# EAGLE schematic MSUT (EAGLE 9.6.2)

## Sheet 1 of 2
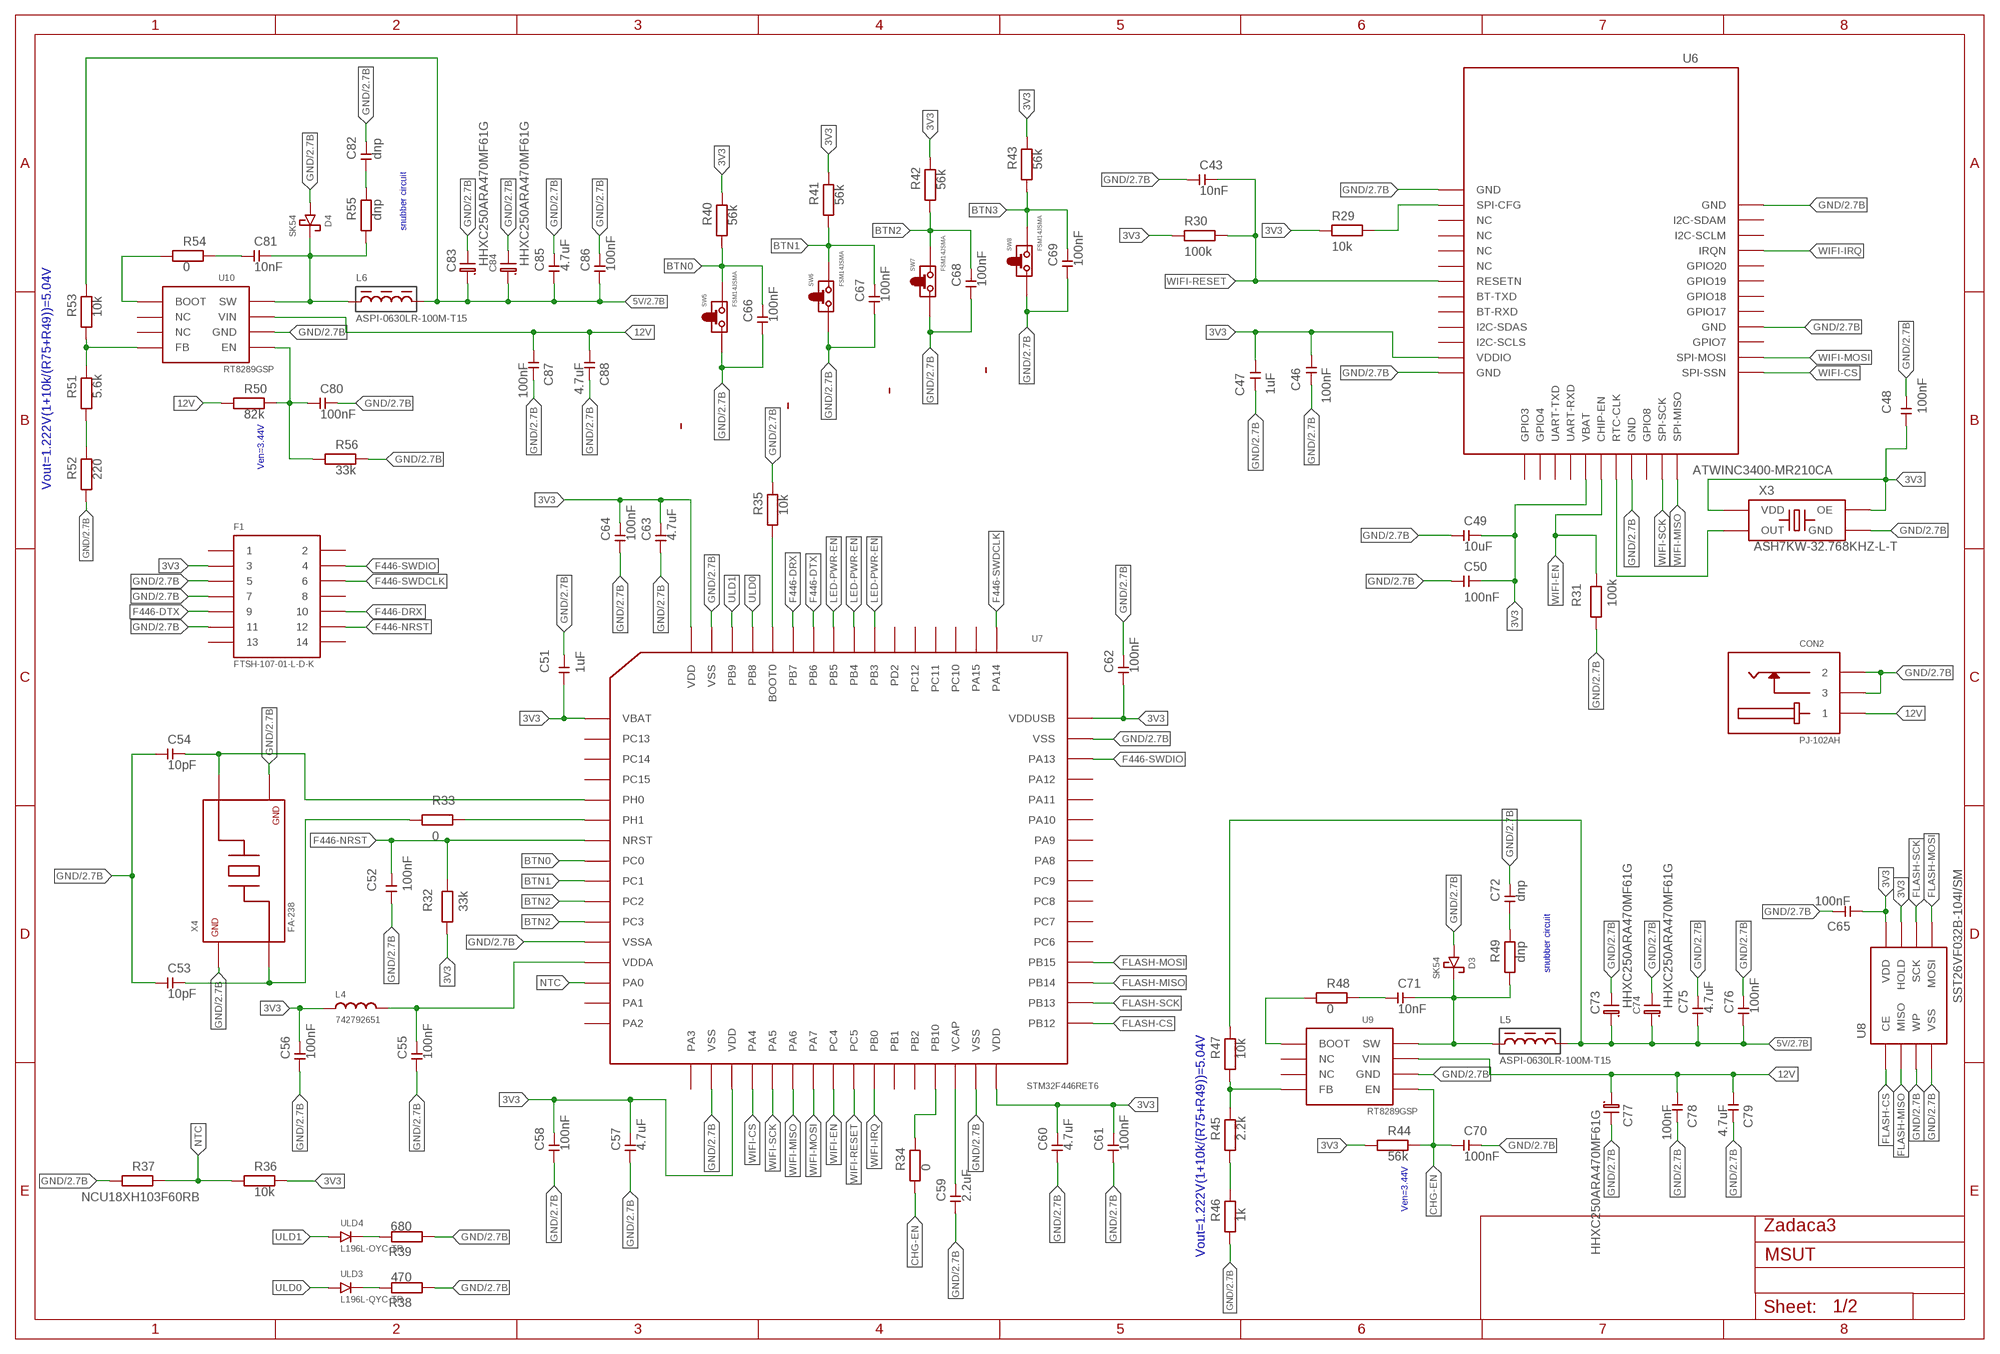
[diagram p0: schematic, sheet 1]

### Parts
C43  10nF  CAPACITORB  [PACKAGE_0805]
C46  100nF  CAPACITORB  [PACKAGE_0805]
C47  1uF  CAPACITORB  [PACKAGE_0805]
C48  100nF  CAPACITORB  [PACKAGE_0805]
C49  10uF  CAPACITORB  [PACKAGE_0805]
C50  100nF  CAPACITORB  [PACKAGE_0805]
C51  1uF  CAPACITORB  [PACKAGE_0805]
C52  100nF  CAPACITORB  [PACKAGE_0805]
C53  10pF  CAPACITORB  [PACKAGE_0805]
C54  10pF  CAPACITORB  [PACKAGE_0805]
C55  100nF  CAPACITORB  [PACKAGE_0805]
C56  100nF  CAPACITORB  [PACKAGE_0805]
C57  4.7uF  CAPACITORB  [PACKAGE_0805]
C58  100nF  CAPACITORB  [PACKAGE_0805]
C59  2.2uF  CAPACITORB  [PACKAGE_0805]
C60  4.7uF  CAPACITORB  [PACKAGE_0805]
C61  100nF  CAPACITORB  [PACKAGE_0805]
C62  100nF  CAPACITORB  [PACKAGE_0805]
C63  4.7uF  CAPACITORB  [PACKAGE_0805]
C64  100nF  CAPACITORB  [PACKAGE_0805]
C65  100nF  CAPACITORB  [PACKAGE_0805]
C66  100nF  CAPACITORB  [PACKAGE_0805]
C67  100nF  CAPACITORB  [PACKAGE_0805]
C68  100nF  CAPACITORB  [PACKAGE_0805]
C69  100nF  CAPACITORB  [PACKAGE_0805]
C70  100nF  CAPACITORB  [PACKAGE_0805]
C71  10nF  CAPACITORB  [PACKAGE_0805]
C72  dnp  CAPACITORB  [PACKAGE_0805]
C73  HHXC250ARA470MF61G  ELECTROLIC_CAPACTIOR  [PACKAGE_EL_CAP_HXC]
C74  HHXC250ARA470MF61G  ELECTROLIC_CAPACTIOR  [PACKAGE_EL_CAP_HXC]
C75  4.7uF  CAPACITORB  [PACKAGE_0805]
C76  100nF  CAPACITORB  [PACKAGE_0805]
C77  HHXB350ARA470MF61G  ELECTROLIC_CAPACTIOR  [PACKAGE_EL_CAP_HXC]
C78  100nF  CAPACITORB  [PACKAGE_0805]
C79  4.7uF  CAPACITORB  [PACKAGE_0805]
C80  100nF  CAPACITORB  [PACKAGE_0805]
C81  10nF  CAPACITORB  [PACKAGE_0805]
C82  dnp  CAPACITORB  [PACKAGE_0805]
C83  HHXC250ARA470MF61G  ELECTROLIC_CAPACTIOR  [PACKAGE_EL_CAP_HXC]
C84  HHXC250ARA470MF61G  ELECTROLIC_CAPACTIOR  [PACKAGE_EL_CAP_HXC]
C85  4.7uF  CAPACITORB  [PACKAGE_0805]
C86  100nF  CAPACITORB  [PACKAGE_0805]
C87  100nF  CAPACITORB  [PACKAGE_0805]
C88  4.7uF  CAPACITORB  [PACKAGE_0805]
CON2  PJ-102AH  PJ-102AH_CONNECTOR  [TRAY_PJ-102AH]
D3  SK54  SHOTTKY_DIODE  [D0-214AB]
D4  SK54  SHOTTKY_DIODE  [D0-214AB]
F1  FTSH-107-01-L-D-K  [TUBE_FTSH-107-01-L-D-K]
L4  742792651  INDUCTOR  [PACKAGE_0805]
L5  ASPI-0630LR-100M-T15  [PACKAGE_ASPI-0630]
L6  ASPI-0630LR-100M-T15  [PACKAGE_ASPI-0630]
R29  10k  RESISTOR  [PACKAGE_0805]
R30  100k  RESISTOR  [PACKAGE_0805]
R31  100k  RESISTOR  [PACKAGE_0805]
R32  33k  RESISTOR  [PACKAGE_0805]
R33  0  RESISTOR  [PACKAGE_0805]
R34  0  RESISTOR  [PACKAGE_0805]
R35  10k  RESISTOR  [PACKAGE_0805]
R36  10k  RESISTOR  [PACKAGE_0805]
R37  NCU18XH103F60RB  RESISTOR  [PACKAGE_0805]
R38  470  RESISTOR  [PACKAGE_0805]
R39  680  RESISTOR  [PACKAGE_0805]
R40  56k  RESISTOR  [PACKAGE_0805]
R41  56k  RESISTOR  [PACKAGE_0805]
R42  56k  RESISTOR  [PACKAGE_0805]
R43  56k  RESISTOR  [PACKAGE_0805]
R44  56k  RESISTOR  [PACKAGE_0805]
R45  2.2k  RESISTOR  [PACKAGE_0805]
R46  1k  RESISTOR  [PACKAGE_0805]
R47  10k  RESISTOR  [PACKAGE_0805]
R48  0  RESISTOR  [PACKAGE_0805]
R49  dnp  RESISTOR  [PACKAGE_0805]
R50  82k  RESISTOR  [PACKAGE_0805]
R51  5.6k  RESISTOR  [PACKAGE_0805]
R52  220  RESISTOR  [PACKAGE_0805]
R53  10k  RESISTOR  [PACKAGE_0805]
R54  0  RESISTOR  [PACKAGE_0805]
R55  dnp  RESISTOR  [PACKAGE_0805]
R56  33k  RESISTOR  [PACKAGE_0805]
SW5  FSM14JSMA  PUSHBUTTON  [FSM14JSMA]
SW6  FSM14JSMA  PUSHBUTTON  [FSM14JSMA]
SW7  FSM14JSMA  PUSHBUTTON  [FSM14JSMA]
SW8  FSM14JSMA  PUSHBUTTON  [FSM14JSMA]
U6  NETWORK_CONTROLLER  [PACKAGE_ATWINC3400-MR210XA]
U7  STM32F446RET6  [TRAY_STM32F446RET6]
U8  SST26VF032B-104I/SM  [8-SOIJ]
U9  RT8289GSP  [8-SOIC]
U10  RT8289GSP  [8-SOIC]
ULD3  L196L-QYC-TR  LED  [TAPE&REEL_DIODE]
ULD4  L196L-OYC-TR  LED  [TAPE&REEL_DIODE]
X3  ASH7KW-32.768KHZ-L-T  [PACKAGE_ASH7KW]
X4  FA-238  [PACKAGE_FA-23816.0000MB-K0]

### Nets
3V3: C46.P1 C47.P1 C48.P1 C49.P2 C50.P2 C51.P1 C56.P2 C57.P2 C58.P2 C60.P2 C61.P2 C62.P1 C63.P2 C64.P2 C65.P1 F1.3 L4.P1(PIN1) R29.P1 R30.P1 R32.P1 R36.P2 R40.P2 R41.P2 R42.P2 R43.P2 R44.P1 U6.VBAT U6.VDDIO U7.VBAT U7.VDD1(VDD) U7.VDD2(VDD) U7.VDD3(VDD) U7.VDDUSB U8.HOLD U8.VDD X3.OE X3.VDD
5V: C73.P1 C74.P1 C75.P1 C76.P1 C83.P1 C84.P1 C85.P1 C86.P1 L5.PIN2 L6.PIN2 R47.P2 R53.P2 ; also sheet 2
12V: C77.P1 C78.P1 C79.P1 C87.P1 C88.P1 CON2.1 R50.P1 U9.VIN U10.VIN
BTN0: C66.P2 R40.P1 SW5.3(PIN2) SW5.4(PIN2) U7.PC0
BTN1: C67.P2 R41.P1 SW6.3(PIN2) SW6.4(PIN2) U7.PC1
BTN2: C68.P2 R42.P1 SW7.3(PIN2) SW7.4(PIN2) U7.PC2 U7.PC3
BTN3: C69.P2 R43.P1 SW8.3(PIN2) SW8.4(PIN2)
CHG-EN: C70.P1 C80.P1 R34.P1 R44.P2 R50.P2 R56.P1 U9.EN U10.EN
F446-DRX: F1.10 U7.PB7
F446-DTX: F1.9 U7.PB6
F446-NRST: C52.P2 F1.12 R32.P2 U7.NRST
F446-SWDCLK: F1.6 U7.PA14
F446-SWDIO: F1.4 U7.PA13
FLASH-CS: U7.PB12 U8.CE
FLASH-MISO: U7.PB14 U8.MISO
FLASH-MOSI: U7.PB15 U8.MOSI
FLASH-SCK: U7.PB13 U8.SCK
GND: C43.P1 C46.P2 C47.P2 C48.P2 C49.P1 C50.P1 C51.P2 C52.P1 C53.P1 C54.P1 C55.P1 C56.P1 C57.P1 C58.P1 C59.P1 C60.P1 C61.P1 C62.P2 C63.P1 C64.P1 C65.P2 C66.P1 C67.P1 C68.P1 C69.P1 C70.P2 C72.P2 C73.P2 C74.P2 C75.P2 C76.P2 C77.P2 C78.P2 C79.P2 C80.P2 C82.P2 C83.P2 C84.P2 C85.P2 C86.P2 C87.P2 C88.P2 CON2.2 CON2.3 D3.ANODE D4.ANODE F1.5 F1.7 F1.11 R31.P1 R35.P2 R37.P1 R38.P1 R39.P1 R46.P1 R52.P1 R56.P2 SW5.1(PIN1) SW5.2(PIN1) SW6.1(PIN1) SW6.2(PIN1) SW7.1(PIN1) SW7.2(PIN1) SW8.1(PIN1) SW8.2(PIN1) U6.GND@1(GND) U6.GND@2(GND) U6.GND@3(GND) U6.GND@4(GND) U6.GND@5(GND) U6.GND@6(GND) U7.VSS1(VSS) U7.VSS2(VSS) U7.VSS3(VSS) U7.VSS4(VSS) U7.VSSA U8.VSS U8.WP U9.GND1(GND) U9.GND2(GND) U10.GND1(GND) U10.GND2(GND) X3.GND X4.2(GND) X4.4(GND) ; also sheet 2
LED-PWR-EN: U7.PB3 U7.PB4 U7.PB5
N$25: R29.P2 U6.SPI-CFG
N$27: U6.RTC-CLK X3.OUT
N$28: R33.P2 U7.PH1
N$29: C53.P2 R33.P1 X4.1(PIN1)
N$30: C54.P2 U7.PH0 X4.3(PIN2)
N$31: C55.P2 L4.P2(PIN2) U7.VDDA
N$32: R34.P2 U7.PB10
N$33: C59.P2 U7.VCAP
N$34: R35.P1 U7.BOOT0
N$35: R38.P2 ULD3.CATHODE
N$36: R39.P2 ULD4.CATHODE
N$37: R45.P2 R47.P1 U9.FB
N$38: R45.P1 R46.P2
N$39: C71.P1 R48.P2
N$40: R48.P1 U9.BOOT
N$41: C71.P2 D3.CATHODE L5.PIN1 R49.P1 U9.SW
N$42: C72.P1 R49.P2
N$43: R51.P2 R53.P1 U10.FB
N$44: R51.P1 R52.P2
N$45: C81.P1 R54.P2
N$46: R54.P1 U10.BOOT
N$47: C81.P2 D4.CATHODE L6.PIN1 R55.P1 U10.SW
N$48: C82.P1 R55.P2
NTC: R36.P1 R37.P2 U7.PA0
ULD0: U7.PB8 ULD3.ANODE
ULD1: U7.PB9 ULD4.ANODE
WIFI-CS: U6.SPI-SSN U7.PA4
WIFI-EN: R31.P2 U6.CHIP-EN U7.PC4
WIFI-IRQ: U6.IRQN U7.PB0
WIFI-MISO: U6.SPI-MISO U7.PA6
WIFI-MOSI: U6.SPI-MOSI U7.PA7
WIFI-RESET: C43.P2 R30.P2 U6.RESETN U7.PC5
WIFI-SCK: U6.SPI-SCK U7.PA5
Unconnected: F1.1 F1.2 F1.8 F1.13 F1.14 U6.BT-RXD U6.BT-TXD U6.GPIO3 U6.GPIO4 U6.GPIO7 U6.GPIO8 U6.GPIO17 U6.GPIO18 U6.GPIO19 U6.GPIO20 U6.I2C-SCLM U6.I2C-SCLS U6.I2C-SDAM U6.I2C-SDAS U6.NC@1(NC) U6.NC@2(NC) U6.NC@3(NC) U6.NC@4(NC) U6.UART-RXD U6.UART-TXD U7.PA1 U7.PA2 U7.PA3 U7.PA8 U7.PA9 U7.PA10 U7.PA11 U7.PA12 U7.PA15 U7.PB1 U7.PB2 U7.PC6 U7.PC7 U7.PC8 U7.PC9 U7.PC10 U7.PC11 U7.PC12 U7.PC13 U7.PC14 U7.PC15 U7.PD2 U9.NC1(NC) U9.NC2(NC) U10.NC1(NC) U10.NC2(NC)

### Notes on the sheet
- snubber circuit
- Ven=3.44V
- Vout=1.222V(1+10k/(R75+R49))=5.04V
- snubber circuit
- Ven=3.44V
- Zadaca3
- Vout=1.222V(1+10k/(R75+R49))=5.04V

## Sheet 2 of 2
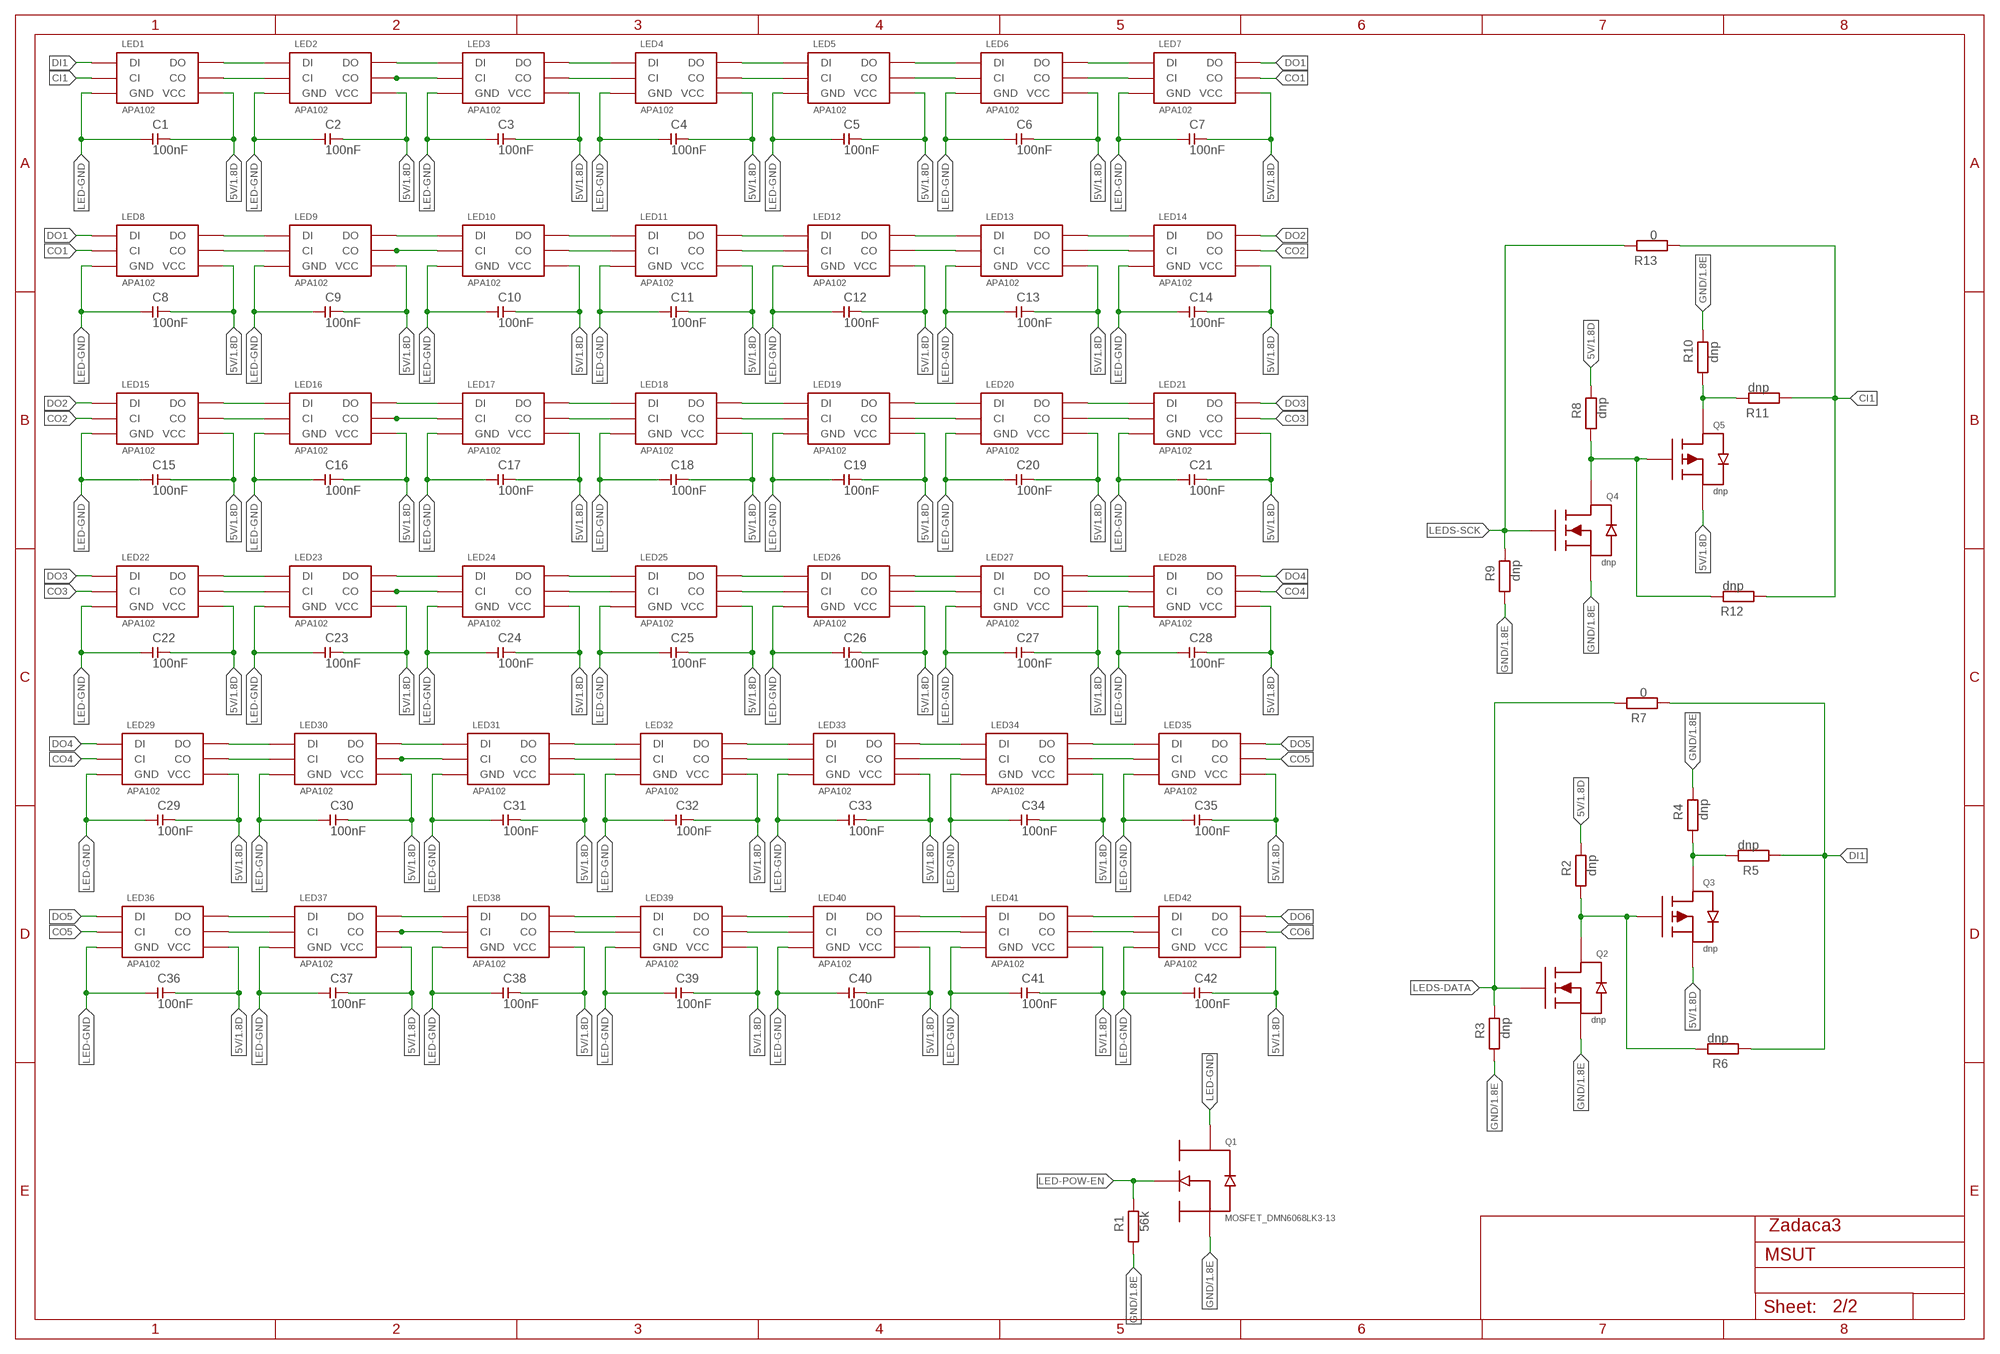
[diagram p1: schematic, sheet 2]

### Parts
C1  100nF  CAPACITORB  [PACKAGE_0805]
C2  100nF  CAPACITORB  [PACKAGE_0805]
C3  100nF  CAPACITORB  [PACKAGE_0805]
C4  100nF  CAPACITORB  [PACKAGE_0805]
C5  100nF  CAPACITORB  [PACKAGE_0805]
C6  100nF  CAPACITORB  [PACKAGE_0805]
C7  100nF  CAPACITORB  [PACKAGE_0805]
C8  100nF  CAPACITORB  [PACKAGE_0805]
C9  100nF  CAPACITORB  [PACKAGE_0805]
C10  100nF  CAPACITORB  [PACKAGE_0805]
C11  100nF  CAPACITORB  [PACKAGE_0805]
C12  100nF  CAPACITORB  [PACKAGE_0805]
C13  100nF  CAPACITORB  [PACKAGE_0805]
C14  100nF  CAPACITORB  [PACKAGE_0805]
C15  100nF  CAPACITORB  [PACKAGE_0805]
C16  100nF  CAPACITORB  [PACKAGE_0805]
C17  100nF  CAPACITORB  [PACKAGE_0805]
C18  100nF  CAPACITORB  [PACKAGE_0805]
C19  100nF  CAPACITORB  [PACKAGE_0805]
C20  100nF  CAPACITORB  [PACKAGE_0805]
C21  100nF  CAPACITORB  [PACKAGE_0805]
C22  100nF  CAPACITORB  [PACKAGE_0805]
C23  100nF  CAPACITORB  [PACKAGE_0805]
C24  100nF  CAPACITORB  [PACKAGE_0805]
C25  100nF  CAPACITORB  [PACKAGE_0805]
C26  100nF  CAPACITORB  [PACKAGE_0805]
C27  100nF  CAPACITORB  [PACKAGE_0805]
C28  100nF  CAPACITORB  [PACKAGE_0805]
C29  100nF  CAPACITORB  [PACKAGE_0805]
C30  100nF  CAPACITORB  [PACKAGE_0805]
C31  100nF  CAPACITORB  [PACKAGE_0805]
C32  100nF  CAPACITORB  [PACKAGE_0805]
C33  100nF  CAPACITORB  [PACKAGE_0805]
C34  100nF  CAPACITORB  [PACKAGE_0805]
C35  100nF  CAPACITORB  [PACKAGE_0805]
C36  100nF  CAPACITORB  [PACKAGE_0805]
C37  100nF  CAPACITORB  [PACKAGE_0805]
C38  100nF  CAPACITORB  [PACKAGE_0805]
C39  100nF  CAPACITORB  [PACKAGE_0805]
C40  100nF  CAPACITORB  [PACKAGE_0805]
C41  100nF  CAPACITORB  [PACKAGE_0805]
C42  100nF  CAPACITORB  [PACKAGE_0805]
LED1  RGB_LED  [TAPE&REEL_LED]
LED2  RGB_LED  [TAPE&REEL_LED]
LED3  RGB_LED  [TAPE&REEL_LED]
LED4  RGB_LED  [TAPE&REEL_LED]
LED5  RGB_LED  [TAPE&REEL_LED]
LED6  RGB_LED  [TAPE&REEL_LED]
LED7  RGB_LED  [TAPE&REEL_LED]
LED8  RGB_LED  [TAPE&REEL_LED]
LED9  RGB_LED  [TAPE&REEL_LED]
LED10  RGB_LED  [TAPE&REEL_LED]
LED11  RGB_LED  [TAPE&REEL_LED]
LED12  RGB_LED  [TAPE&REEL_LED]
LED13  RGB_LED  [TAPE&REEL_LED]
LED14  RGB_LED  [TAPE&REEL_LED]
LED15  RGB_LED  [TAPE&REEL_LED]
LED16  RGB_LED  [TAPE&REEL_LED]
LED17  RGB_LED  [TAPE&REEL_LED]
LED18  RGB_LED  [TAPE&REEL_LED]
LED19  RGB_LED  [TAPE&REEL_LED]
LED20  RGB_LED  [TAPE&REEL_LED]
LED21  RGB_LED  [TAPE&REEL_LED]
LED22  RGB_LED  [TAPE&REEL_LED]
LED23  RGB_LED  [TAPE&REEL_LED]
LED24  RGB_LED  [TAPE&REEL_LED]
LED25  RGB_LED  [TAPE&REEL_LED]
LED26  RGB_LED  [TAPE&REEL_LED]
LED27  RGB_LED  [TAPE&REEL_LED]
LED28  RGB_LED  [TAPE&REEL_LED]
LED29  RGB_LED  [TAPE&REEL_LED]
LED30  RGB_LED  [TAPE&REEL_LED]
LED31  RGB_LED  [TAPE&REEL_LED]
LED32  RGB_LED  [TAPE&REEL_LED]
LED33  RGB_LED  [TAPE&REEL_LED]
LED34  RGB_LED  [TAPE&REEL_LED]
LED35  RGB_LED  [TAPE&REEL_LED]
LED36  RGB_LED  [TAPE&REEL_LED]
LED37  RGB_LED  [TAPE&REEL_LED]
LED38  RGB_LED  [TAPE&REEL_LED]
LED39  RGB_LED  [TAPE&REEL_LED]
LED40  RGB_LED  [TAPE&REEL_LED]
LED41  RGB_LED  [TAPE&REEL_LED]
LED42  RGB_LED  [TAPE&REEL_LED]
Q1  MOSFET_DMN6068LK3-13  [TO252-3L]
Q2  NCHANNEL_MOSFET  [SOT-23-3]
Q3  PCHANNEL_MOSFET  [SOT-23-3]
Q4  NCHANNEL_MOSFET  [SOT-23-3]
Q5  PCHANNEL_MOSFET  [SOT-23-3]
R1  56k  RESISTOR  [PACKAGE_0805]
R2  dnp  RESISTOR  [PACKAGE_0805]
R3  dnp  RESISTOR  [PACKAGE_0805]
R4  dnp  RESISTOR  [PACKAGE_0805]
R5  dnp  RESISTOR  [PACKAGE_0805]
R6  dnp  RESISTOR  [PACKAGE_0805]
R7  0  RESISTOR  [PACKAGE_0805]
R8  dnp  RESISTOR  [PACKAGE_0805]
R9  dnp  RESISTOR  [PACKAGE_0805]
R10  dnp  RESISTOR  [PACKAGE_0805]
R11  dnp  RESISTOR  [PACKAGE_0805]
R12  dnp  RESISTOR  [PACKAGE_0805]
R13  0  RESISTOR  [PACKAGE_0805]

### Nets
5V: C1.P2 C2.P2 C3.P2 C4.P2 C5.P2 C6.P2 C7.P2 C8.P2 C9.P2 C10.P2 C11.P2 C12.P2 C13.P2 C14.P2 C15.P2 C16.P2 C17.P2 C18.P2 C19.P2 C20.P2 C21.P2 C22.P2 C23.P2 C24.P2 C25.P2 C26.P2 C27.P2 C28.P2 C29.P2 C30.P2 C31.P2 C32.P2 C33.P2 C34.P2 C35.P2 C36.P2 C37.P2 C38.P2 C39.P2 C40.P2 C41.P2 C42.P2 LED1.VDD(VCC) LED2.VDD(VCC) LED3.VDD(VCC) LED4.VDD(VCC) LED5.VDD(VCC) LED6.VDD(VCC) LED7.VDD(VCC) LED8.VDD(VCC) LED9.VDD(VCC) LED10.VDD(VCC) LED11.VDD(VCC) LED12.VDD(VCC) LED13.VDD(VCC) LED14.VDD(VCC) LED15.VDD(VCC) LED16.VDD(VCC) LED17.VDD(VCC) LED18.VDD(VCC) LED19.VDD(VCC) LED20.VDD(VCC) LED21.VDD(VCC) LED22.VDD(VCC) LED23.VDD(VCC) LED24.VDD(VCC) LED25.VDD(VCC) LED26.VDD(VCC) LED27.VDD(VCC) LED28.VDD(VCC) LED29.VDD(VCC) LED30.VDD(VCC) LED31.VDD(VCC) LED32.VDD(VCC) LED33.VDD(VCC) LED34.VDD(VCC) LED35.VDD(VCC) LED36.VDD(VCC) LED37.VDD(VCC) LED38.VDD(VCC) LED39.VDD(VCC) LED40.VDD(VCC) LED41.VDD(VCC) LED42.VDD(VCC) Q3.SOURCE Q5.SOURCE R2.P2 R8.P2 ; also sheet 1
CI1: LED1.CI R11.P1 R12.P1 R13.P1
CO1: LED7.CO LED8.CI
CO2: LED14.CO LED15.CI
CO3: LED21.CO LED22.CI
CO4: LED28.CO LED29.CI
CO5: LED35.CO LED36.CI
CO6: LED42.CO
DI1: LED1.DI R5.P1 R6.P1 R7.P1
DO1: LED7.DO LED8.DI
DO2: LED14.DO LED15.DI
DO3: LED21.DO LED22.DI
DO4: LED28.DO LED29.DI
DO5: LED35.DO LED36.DI
DO6: LED42.DO
GND: Q1.DRAIN Q2.SOURCE Q4.SOURCE R1.P1 R3.P1 R4.P2 R9.P1 R10.P2 ; also sheet 1
LED-GND: C1.P1 C2.P1 C3.P1 C4.P1 C5.P1 C6.P1 C7.P1 C8.P1 C9.P1 C10.P1 C11.P1 C12.P1 C13.P1 C14.P1 C15.P1 C16.P1 C17.P1 C18.P1 C19.P1 C20.P1 C21.P1 C22.P1 C23.P1 C24.P1 C25.P1 C26.P1 C27.P1 C28.P1 C29.P1 C30.P1 C31.P1 C32.P1 C33.P1 C34.P1 C35.P1 C36.P1 C37.P1 C38.P1 C39.P1 C40.P1 C41.P1 C42.P1 LED1.GND LED2.GND LED3.GND LED4.GND LED5.GND LED6.GND LED7.GND LED8.GND LED9.GND LED10.GND LED11.GND LED12.GND LED13.GND LED14.GND LED15.GND LED16.GND LED17.GND LED18.GND LED19.GND LED20.GND LED21.GND LED22.GND LED23.GND LED24.GND LED25.GND LED26.GND LED27.GND LED28.GND LED29.GND LED30.GND LED31.GND LED32.GND LED33.GND LED34.GND LED35.GND LED36.GND LED37.GND LED38.GND LED39.GND LED40.GND LED41.GND LED42.GND Q1.SOURCE
LED-POW-EN: Q1.GATE R1.P2
LEDS-DATA: Q2.GATE R3.P2 R7.P2
LEDS-SCK: Q4.GATE R9.P2 R13.P2
N$1: LED1.DO LED2.DI
N$2: LED1.CO LED2.CI
N$3: LED2.DO LED3.DI
N$4: LED2.CO LED3.CI
N$5: LED3.DO LED4.DI
N$6: LED3.CO LED4.CI
N$7: LED4.DO LED5.DI
N$8: LED4.CO LED5.CI
N$9: LED5.DO LED6.DI
N$10: LED5.CO LED6.CI
N$11: LED6.DO LED7.DI
N$12: LED6.CO LED7.CI
N$13: LED8.DO LED9.DI
N$14: LED8.CO LED9.CI
N$15: LED9.DO LED10.DI
N$16: LED9.CO LED10.CI
N$17: LED10.DO LED11.DI
N$18: LED10.CO LED11.CI
N$19: LED11.DO LED12.DI
N$20: LED11.CO LED12.CI
N$21: LED12.DO LED13.DI
N$22: LED12.CO LED13.CI
N$23: LED13.DO LED14.DI
N$24: LED13.CO LED14.CI
N$49: LED15.DO LED16.DI
N$50: LED15.CO LED16.CI
N$51: LED16.DO LED17.DI
N$52: LED16.CO LED17.CI
N$53: LED17.DO LED18.DI
N$54: LED17.CO LED18.CI
N$55: LED18.DO LED19.DI
N$56: LED18.CO LED19.CI
N$57: LED19.DO LED20.DI
N$58: LED19.CO LED20.CI
N$59: LED20.DO LED21.DI
N$60: LED20.CO LED21.CI
N$61: LED22.DO LED23.DI
N$62: LED22.CO LED23.CI
N$63: LED23.DO LED24.DI
N$64: LED23.CO LED24.CI
N$65: LED24.DO LED25.DI
N$66: LED24.CO LED25.CI
N$67: LED25.DO LED26.DI
N$68: LED25.CO LED26.CI
N$69: LED26.DO LED27.DI
N$70: LED26.CO LED27.CI
N$71: LED27.DO LED28.DI
N$72: LED27.CO LED28.CI
N$73: LED29.DO LED30.DI
N$74: LED29.CO LED30.CI
N$75: LED30.DO LED31.DI
N$76: LED30.CO LED31.CI
N$77: LED31.DO LED32.DI
N$78: LED31.CO LED32.CI
N$79: LED32.DO LED33.DI
N$80: LED32.CO LED33.CI
N$81: LED33.DO LED34.DI
N$82: LED33.CO LED34.CI
N$83: LED34.DO LED35.DI
N$84: LED34.CO LED35.CI
N$85: LED36.DO LED37.DI
N$86: LED36.CO LED37.CI
N$87: LED37.DO LED38.DI
N$88: LED37.CO LED38.CI
N$89: LED38.DO LED39.DI
N$90: LED38.CO LED39.CI
N$91: LED39.DO LED40.DI
N$92: LED39.CO LED40.CI
N$93: LED40.DO LED41.DI
N$94: LED40.CO LED41.CI
N$95: LED41.DO LED42.DI
N$96: LED41.CO LED42.CI
N$97: Q2.DRAIN Q3.GATE R2.P1 R6.P2
N$98: Q3.DRAIN R4.P1 R5.P2
N$99: Q4.DRAIN Q5.GATE R8.P1 R12.P2
N$100: Q5.DRAIN R10.P1 R11.P2

### Notes on the sheet
- Zadaca3

## Library data of the parts
C1-C43 C46-C72 C75 C76 C78-C82 C85-C88 = RLC:CAPACITOR
C73 C74 C77 C83 C84 = RLC:ELECTROLIC_CAPACTIOR
CON2 = RLC:PJ-102AH_CONNECTOR
D3 D4 = RLC:SHOTTKY_DIODE
F1 = RLC:FTSH-107-01-L-D-K
L4 = RLC:INDUCTOR
L5 L6 = RLC:ASPI-0630LR-100M-T15
LED1-LED42 = RLC:RGB_LED
Q1 = RLC:MOSFET_DMN6068LK3-13
Q2 Q4 = RLC:NCHANNEL_MOSFET
Q3 Q5 = RLC:PCHANNEL_MOSFET
R1-R13 R29-R56 = RLC:RESISTOR
SW5-SW8 = RLC:PUSHBUTTON
U6 = RLC:NETWORK_CONTROLLER
U7 = RLC:STM32F446RET6
U8 = RLC:SST26VF032B-104I/SM
U9 U10 = RLC:RT8289GSP
ULD3 ULD4 = RLC:LED
X3 = RLC:ASH7KW-32.768KHZ-L-T
X4 = RLC:FA-238